# Altium schematic sheet ethernet.SchDoc
size A4
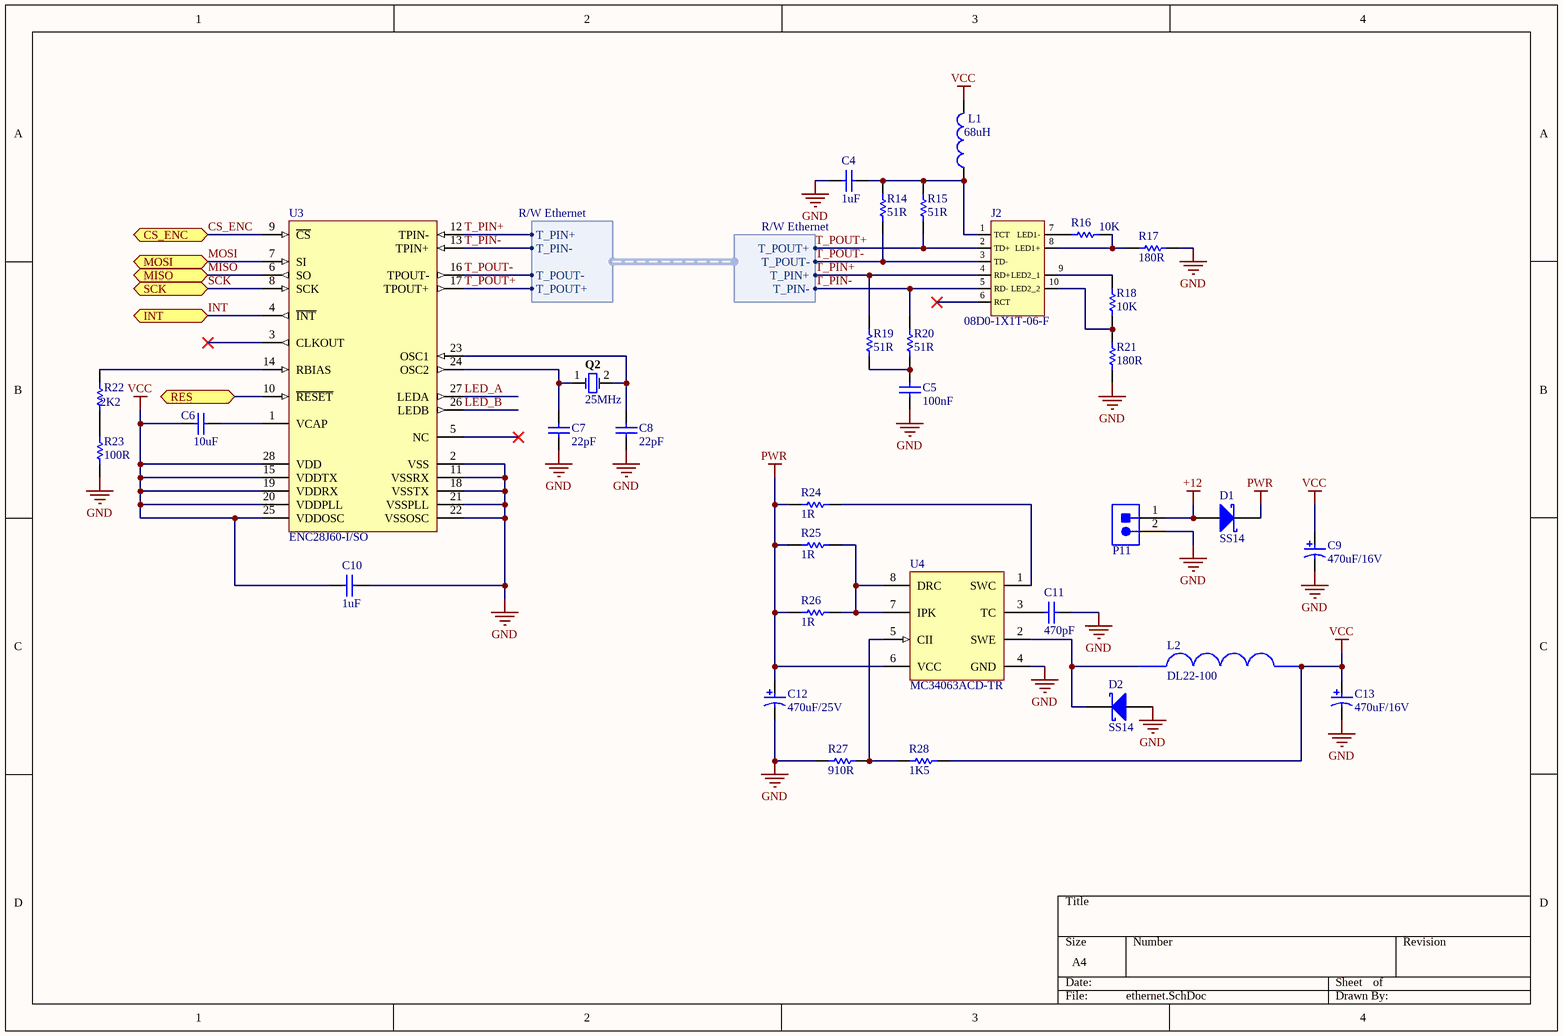
[diagram p0: ethernet.SchDoc]

## Parts
C4  1uF  [CAPC1206(3216)150_L]
C5  100nF  [CAPC1206(3216)190_L]
C6  10uF  [CAPC1206(3216)190_L]
C7  22pF  [CAPC1206(3216)100_L]
C8  22pF  [CAPC1206(3216)100_L]
C9  470uF/16V  [PNSC-FK-V-F_V]
C10  1uF  [CAPC1206(3216)130_L]
C11  470pF  [CAPC1206(3216)100_L]
C12  470uF/25V  [NIC-CAPA2-10X10_V]
C13  470uF/16V  [PNSC-FK-V-F_V]
D1  SS14  [FAIR-DO-214AC-2_V]
D2  SS14  [FAIR-DO-214AC-2_V]
J2  08D0-1X1T-06-F  [PCB_08D0-1X1T-06-F]
L1  value 68uH  [0603]  (hidden comment: Inductor)
L2  DL22-100  [DL22]
P11  SCREW-5.0/5.08 2WAYS  [SCREW-5.0-2WAYS_V]  (value not drawn)
Q2  25MHz  [JPY-HC-49US]
R14  51R  [RESC1206(3216)_L]
R15  51R  [RESC1206(3216)_L]
R16  10K  [RESC1206(3216)_L]
R17  180R  [RESC1206(3216)_L]
R18  10K  [RESC1206(3216)_L]
R19  51R  [RESC1206(3216)_L]
R20  51R  [RESC1206(3216)_L]
R21  180R  [RESC1206(3216)_L]
R22  2K2  [RESC1206(3216)_L]
R23  100R  [RESC1206(3216)_L]
R24  1R  [RESC1206(3216)_L]
R25  1R  [RESC1206(3216)_L]
R26  1R  [RESC1206(3216)_L]
R27  910R  [RESC1206(3216)_L]
R28  1K5  [RESC1206(3216)_L]
U3  ENC28J60-I/SO  [SOIC-SO28_L]
U4  MC34063ACD-TR  [SO8_L]

## Ports
CS_ENC (bidir), INT (bidir), MISO (bidir), MOSI (bidir), RES (bidir), SCK (bidir)

## Harnesses
R/W Ethernet: T_PIN+, T_PIN-, T_POUT-, T_POUT+
R/W Ethernet: T_POUT+, T_POUT-, T_PIN+, T_PIN-

## Nets
+12: D1.2(A) P11.1
GND: C4.1 C5.1 C7.1 C8.1 C9.2 C10.1 C11.2 C12.2 C13.2 D2.2(A) P11.2 R17.2 R21.1 R23.1 R27.1 U3.2(VSS) U3.11(VSSRX) U3.18(VSSTX) U3.21(VSSPLL) U3.22(VSSOSC) U4.4(GND)
PWR: C12.1 D1.1(K) R24.1 R25.1 R26.1 U4.6(VCC)
VCC: C6.1 C9.1 C10.2 C13.1 L1.2 L2.2 R28.2 U3.15(VDDTX) U3.19(VDDRX) U3.20(VDDPLL) U3.25(VDDOSC) U3.28(VDD)
CS_ENC: U3.9(~{CS}) ; port CS_ENC
INT: U3.4(~{INT}) ; port INT
LED_A: U3.27(LEDA)
LED_B: U3.26(LEDB)
MISO: U3.6(SO) ; port MISO
MOSI: U3.7(SI) ; port MOSI
RES: U3.10(~{RESET}) ; port RES
SCK: U3.8(SCK) ; port SCK
T_PIN+: J2.4(RD+) R19.2 U3.12(TPIN-) ; harness R/W Ethernet.T_PIN+
T_PIN-: J2.5(RD-) R20.2 U3.13(TPIN+) ; harness R/W Ethernet.T_PIN-
T_POUT+: J2.2(TD+) R15.1 U3.17(TPOUT+) ; harness R/W Ethernet.T_POUT+
T_POUT-: J2.3(TD-) R14.1 U3.16(TPOUT-) ; harness R/W Ethernet.T_POUT-
NetC4_2: C4.2 J2.1(TCT) L1.1 R14.2 R15.2
NetC5_2: C5.2 R19.1 R20.1
NetC6_2: C6.2 U3.1(VCAP)
NetC7_2: C7.2 Q2.1 U3.24(OSC2)
NetC8_2: C8.2 Q2.2 U3.23(OSC1)
NetC11_1: C11.1 U4.3(TC)
NetD2_1: D2.1(K) L2.1 U4.2(SWE)
NetJ2_7: J2.7(LED1-) R16.2
NetJ2_8: J2.8(LED1+) R16.1 R17.1
NetJ2_9: J2.9(LED2_1) R18.2
NetJ2_10: J2.10(LED2_2) R18.1 R21.2
NetR22_1: R22.1 R23.2
NetR22_2: R22.2 U3.14(RBIAS)
NetR24_2: R24.2 U4.1(SWC)
NetR25_2: R25.2 R26.2 U4.7(IPK) U4.8(DRC)
NetR27_2: R27.2 R28.1 U4.5(CII)

Not connected (* = marked no-connect by the designer): J2 6(RCT)*; U3 3(CLKOUT)* 5(NC)*

## Library data of the parts
C4 = CMP-1037-04667-1: CAP 1uF 6.3V ±5% 1206 (3216 Metric) Thickness 1.45mm SMD; Case-Metric: 3216; Tolerance: Â±5%; Case-EIA: 1206; Value: 1uF; Technology: SMT; Max Thickness: 1.45 mm; Rated Voltage: 6.3 V
C5 = CMP-1037-04169-1: CAP 100nF 10V ±1% 1206 (3216 Metric) Thickness 1.9mm SMD; Case-EIA: 1206; Tolerance: Â±1%; Case-Metric: 3216; Value: 100nF; Rated Voltage: 10 V; Max Thickness: 1.9 mm; Technology: SMT
C6 = CMP-1037-04960-1: CAP 10uF 6.3V ±5% 1206 (3216 Metric) Thickness 1.9mm SMD; Tolerance: Â±5%; Case-EIA: 1206; Case-Metric: 3216; Max Thickness: 1.9 mm; Value: 10uF; Technology: SMT; Rated Voltage: 6.3 V
C7 C8 = CMP-1037-00952-1: CAP 22pF 10V ±0.25pF 1206 (3216 Metric) Thickness 1mm SMD; Tolerance: Â±0.25pF; Case-EIA: 1206; Case-Metric: 3216; Rated Voltage: 10 V; Technology: SMT; Max Thickness: 1 mm; Value: 22pF
C9 C13 = CMP-2000-06204-1: Aluminum Electrolytic Capacitor, 470 uF, +/- 20%, 16 V, 2-Pin SMD (Size Code F), -55 to 105 degC, RoHS, Tape and Reel; Manufacturer: Panasonic; Capacitance: 470µF; Type: Can; Ripple Current: 600mA; Lifetime@Temperature: 2000Hrs@105°C; Impedance: 0.16O; Rated Voltage: 16V; Manufacturer URL: http://www.panasonic.com/; Package Description: 2-Pin Electrolytic Aluminum Capacitor, Body 8.3 x 8.3 mm; Operating Temp-Max: 105°C; Mounting Technology: SurfaceMount; Operating Temp Range: -55to+105°C; Datasheet Version: 03/2016; Series: FK; Package Reference: FK-V-F; Case Size/Dimension: Ø8x10.2mm; Package URL: http://industrial.panasonic.com/cdbs/www-data/pdf/RDE0000/DME0000COL48.pdf; Datasheet URL: http://industrial.panasonic.com/cdbs/www-data/pdf/RDE0000/ABA0000C1181.pdf
C10 = CMP-1037-04671-1: CAP 1uF 10V ±5% 1206 (3216 Metric) Thickness 1.3mm SMD; Case-EIA: 1206; Tolerance: Â±5%; Case-Metric: 3216; Value: 1uF; Technology: SMT; Rated Voltage: 10 V; Max Thickness: 1.3 mm
C11 = CMP-1037-02128-1: CAP 470pF 10V ±1% 1206 (3216 Metric) Thickness 1mm SMD; Case-EIA: 1206; Case-Metric: 3216; Tolerance: Â±1%; Technology: SMT; Value: 470pF; Max Thickness: 1 mm; Rated Voltage: 10 V
C12 = CMP-0687-00002-1: Aluminum Electrolytic Capacitor, UD Series, Low Impedance, 470 uF, 25 V, + / - 20%, -55 to 105 degC, Chip Type, 10 x 10 mm D x L, Pb-Free, Reel; PartNumber: UUD1E471MNL1GS; Manufacturer: Nichicon; Impedance: 0.09 Ohm; Endurance Time: 5000 h; Rated Ripple Current (at 100kHz): 670 mA; Rated Capacitance: 470 uF; Packing: Dia382mm Reel; Rated Voltage: 25 V; Tolerance Rated Capacitance: -20 to 20%; ComponentLink3URL: http://products.nichicon.co.jp/en/pdf/XJA043/e-ud.pdf; ComponentLink2URL: http://products.nichicon.co.jp/en/pdf/XJA043/e-ud.pdf; Length: 10 mm; ComponentLink3Description: Package Specification; PackageReference: CAPAE-D10H10; ComponentLink1URL: http://www.nichicon.co.jp/; DatasheetVersion: 08/2012; ComponentLink1Description: Manufacturer URL; ComponentLink2Description: Datasheet; Diameter: 10 mm; PackageDescription: 2-Pin Surface Mount Device, Diameter 10 mm, Height 10 mm, Pitch 8 mm; RoHS: TRUE; Mounting Technology: Surface Mount
D1 D2 = CMP-2000-04943-1: Schottky Rectifier, 1.1 W, -65 to 125 degC, 2-Pin SMD, RoHS, Tape and Reel; Manufacturer: Fairchild; Configuration: SINGLE; Diode Element Material: SILICON; Power Dissipation Limit-Max (W): 1.1; Additional Feature: FREEWHEELINGDIODE; Signal Diode Type: SIGNALDIODE; Number of Elements: 1; JEDEC-95 Code: DO-214AC; Rep Pk Reverse Voltage-Max (V): 40; Package Body Material: PLASTIC/EPOXY; CAGE Code: 1HBD3,07933,59621,7D893; Peak Reflow Temperature (Cel): 260; Package Shape: RECTANGULAR; Manufacturer URL: https://www.fairchildsemi.com/; JESD-97 Code: e3; Package Reference: DO-214AC-2; RoHS Compliant: YES; Package Description: 2-Pin Surface Mount Device, Body 4.375 x 2.725 mm; Technology: SCHOTTKY; Surface Mount: YES; Datasheet URL: http://www.onlinecomponents.com/datasheet/ss14.aspx?p=11369800; Terminal Form: CBEND; Package Style: SMALLOUTLINE; Number of Terminals: 2; JESD-30 Code: R-PDSO-C2; Average Forward Current-Max (A): 1; Terminal Finish: MATTETIN; Datasheet Version: Oct-13; Terminal Position: DUAL; Package URL: https://www.fairchildsemi.com/package-drawings/DO/DO214AC.pdf; Moisture Sensitivity Level: 1; Lead Free: YES
P11 = CMP-0617-00009-1: Socket, Screw Terminal Block, 2 Way, 5.0 mm Pitch, 90 Degree Angle, Through-Hole; Manufacturer: No Vendor; Insulation Resistance: 5000 MOhm / 1000 V; Contact Resistance: 20 mOhm; Rated Current: 25 A; Poles: 2; Rated Voltage: 300 V; PartNumber: SCREW-5.0/5.08 2WAYS; ComponentLink1Description: Datasheet; ComponentLink1URL: 5mm screw terminal in SVN; Mounting Technology: Through Hole; PackageDescription: Socket, Screw Terminal Block, 2 Way, Pitch 5 mm, 90 Degree Angle, Through-Hole; Temperature Range: -40 to 105 degC
Q2 = CMP-2100-03645-1: Crystal, 25 MHz, +/- 30 ppm, 22 pF, -20 to 70 degC, 2-Pin THD; Manufacturer: Jing peng yuan; Datasheet URL: https://pl.mouser.com/datasheet/2/96/008-0308-0-1160929.pdf; Package Description: 2-Pin Throug Hole Device, Body 11.05 x 4.65 mm, Pitch 4.9 mm; Datasheet Version: 42125.0; Package Reference: HC-49U
R14 R15 R19 R20 = CMP-1014-00364-1: 51R 0.25W 1% 1206 (3216 Metric)  SMD; Value: 51.00 Ohm; Case-EIA: 1206; Case-Metric: 3216; Tolerance: 1 %; Technology: SMT; Power: 0.25 W
R16 R18 = CMP-1014-00623-1: 10K 0.25W 1% 1206 (3216 Metric)  SMD; Case-Metric: 3216; Value: 10000.00 Ohm; Case-EIA: 1206; Power: 0.25 W; Technology: SMT; Tolerance: 1 %
R17 R21 = CMP-1014-00424-1: 180R 0.25W 1% 1206 (3216 Metric)  SMD; Case-Metric: 3216; Value: 180.00 Ohm; Case-EIA: 1206; Tolerance: 1 %; Power: 0.25 W; Technology: SMT
R22 = CMP-1014-00546-1: 2K2 0.25W 1% 1206 (3216 Metric)  SMD; Value: 2200.00 Ohm; Case-Metric: 3216; Case-EIA: 1206; Power: 0.25 W; Technology: SMT; Tolerance: 1 %
R23 = CMP-1014-00397-1: 100R 0.25W 1% 1206 (3216 Metric)  SMD; Value: 100.00 Ohm; Case-Metric: 3216; Case-EIA: 1206; Technology: SMT; Tolerance: 1 %; Power: 0.25 W
R24-R26 = CMP-1014-00171-1: 1R 0.25W 1% 1206 (3216 Metric)  SMD; Case-EIA: 1206; Value: 1.00 Ohm; Case-Metric: 3216; Technology: SMT; Power: 0.25 W; Tolerance: 1 %
R27 = CMP-1014-00506-1: 910R 0.25W 1% 1206 (3216 Metric)  SMD; Case-Metric: 3216; Case-EIA: 1206; Value: 910.00 Ohm; Technology: SMT; Power: 0.25 W; Tolerance: 1 %
R28 = CMP-1014-00528-1: 1K5 0.25W 1% 1206 (3216 Metric)  SMD; Case-EIA: 1206; Case-Metric: 3216; Value: 1500.00 Ohm; Tolerance: 1 %; Technology: SMT; Power: 0.25 W
U3 = CMP-0186-00132-2: Stand-Alone Ethernet Controller with SPI Interface, 28-Pin SOIC, Industrial Temperature; Code_JEDEC: MS-013; ComponentLink2URL: http://ww1.microchip.com/downloads/en/DeviceDoc/39662c.pdf; PackageDescription: 28-Lead Plastic Small Outline (SO) - Wide 7.50mm Body [SOIC]; RevisionNote: URLs added.; ComponentLink2Description: Datasheet; ComponentLink1Description: Manufacturer URL; ComponentLink3Description: Package Specification; DatasheetVersion: revC, Jan-2008; ComponentLink1URL: http://www.microchip.com/; ComponentLink3URL: http://www.microchip.com/stellent/groups/techpub_sg/documents/packagingspec/en012702.pdf; PackageVersion: revBB, Aug-2009; PackageReference: SOIC-SO28
U4 = CMP-0241-00016-1: DC/DC converter control circuit, 8-Pin SO, Tape and Reel; Code_IPC: SOIC127P600-8; ComponentLink2Description: Datasheet; ComponentLink3Description: Package Specification; PackageDescription: 8-Pin Small Outline Integrated Circuit 1.27 mm Pitch; Code_JEDEC: MS-012-AA; ComponentLink3URL: http://www.st.com/internet/com/TECHNICAL_RESOURCES/TECHNICAL_LITERATURE/PACKAGE_INFORMATION/CD00004680.pdf; ComponentLink1Description: Manufacturer URL; ComponentLink1URL: http://www.st.com; DatasheetVersion: Nov-2007; ComponentLink2URL: http://www.st.com/internet/com/TECHNICAL_RESOURCES/TECHNICAL_LITERATURE/DATASHEET/CD00001232.pdf; PackageReference: SO8; PackageVersion: Dec-2002
J2 = 08D0-1X1T-06-F: supplier 1: Digi-Key; supplier part number 1: 507-1445-ND; helpurl: https://www.belfuse.com/resources/ICMs/ICMs%20Drawings/08B0-1X1T-06-F.pdf
L1 = Inductor: Published: 8-Jun-2000; Publisher: Altium Limited
L2 = DL22-100: supplier 1: TME; supplier part number 1: DL22-100; helpurl: https://www.tme.eu/pl/Document/6ba894df3330489656add27ab934f082/dl2250.pdf